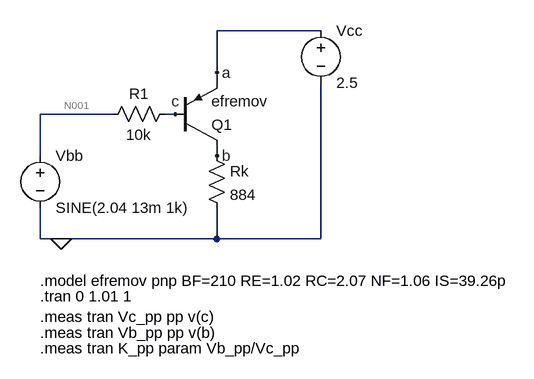
[diagram p0: schematic 2b.asc]
2b.asc, the LTspice schematic file:
Version 4
SHEET 1 880 680
WIRE 384 48 224 48
WIRE 224 112 224 48
WIRE 224 128 224 112
WIRE 64 176 -48 176
WIRE 160 176 144 176
WIRE -48 240 -48 176
WIRE 224 240 224 224
WIRE -48 368 -48 320
WIRE -16 368 -48 368
WIRE 224 368 224 320
WIRE 224 368 -16 368
WIRE 384 368 384 128
WIRE 384 368 224 368
FLAG -16 368 0
FLAG 224 112 a
FLAG 224 240 b
FLAG 160 176 c
SYMBOL pnp 160 224 M180
SYMATTR InstName Q1
SYMATTR Value efremov
SYMBOL voltage 384 32 R0
WINDOW 123 0 0 Left 0
WINDOW 39 0 0 Left 0
SYMATTR InstName Vcc
SYMATTR Value 2.5
SYMBOL res 160 160 R90
WINDOW 0 0 56 VBottom 2
WINDOW 3 32 56 VTop 2
SYMATTR InstName R1
SYMATTR Value 10k
SYMBOL res 208 224 R0
SYMATTR InstName Rk
SYMATTR Value 884
SYMBOL voltage -48 224 R0
WINDOW 123 0 0 Left 0
WINDOW 39 0 0 Left 0
SYMATTR InstName Vbb
SYMATTR Value SINE(2.04 13m 1k)
TEXT -48 432 Left 2 !.model efremov pnp BF=210 RE=1.02 RC=2.07 NF=1.06 IS=39.26p
TEXT -48 456 Left 2 !.tran 0 1.01 1
TEXT -48 488 Left 2 !.meas tran Vc_pp pp v(c)
TEXT -48 512 Left 2 !.meas tran Vb_pp pp v(b)
TEXT -48 536 Left 2 !.meas tran K_pp param Vb_pp/Vc_pp

The netlist it stands for:
* 2b.asc
Q1 b c a 0 efremov
Vcc a 0 2.5
R1 c N001 10k
Rk b 0 884
Vbb N001 0 SINE(2.04 13m 1k)
.model NPN NPN
.model PNP PNP
.lib standard.bjt
.model efremov pnp BF=210 RE=1.02 RC=2.07 NF=1.06 IS=39.26p
.tran 0 1.01 1
.meas tran Vc_pp pp v(c)
.meas tran Vb_pp pp v(b)
.meas tran K_pp param Vb_pp/Vc_pp
.backanno
.end

* Results of the author's LTspice run, read from the files saved beside the schematic
* Operating Point, zero values left out:
*   V(b) = 339.6 mV
*   V(c) = 2.058 V
*   V(a) = 2.5 V
*   V(n001) = 2.04 V
*   Ic(Q1) = -384.2 µA
*   Ib(Q1) = -1.829 µA
*   Ie(Q1) = 386 µA
*   I(Rk) = 384.2 µA
*   I(R1) = 1.829 µA
*   I(Vbb) = 1.829 µA
*   I(Vcc) = -386 µA
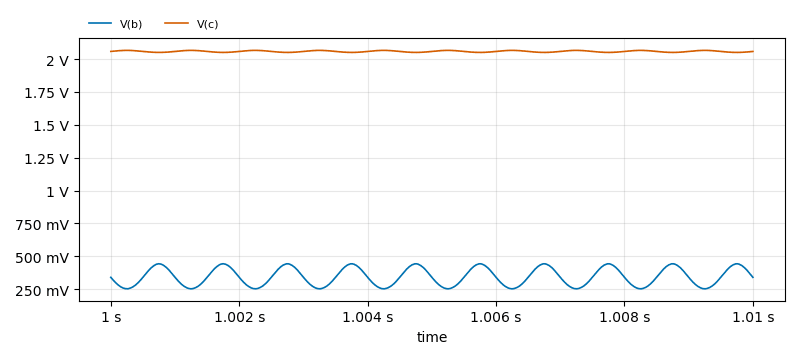
[diagram p1: Transient Analysis of 2b.asc, plotted from the saved traces]
* Transient Analysis, 1 run:
*   V(b): min 252.2 mV, max 442.9 mV, average 343.6 mV, rms 350.2 mV, last 339.6 mV
*   V(c): min 2.051 V, max 2.067 V, average 2.059 V, rms 2.059 V, last 2.058 V
* From the log:
*   vc_pp: PP(v(c))=0.0156603 FROM 0 TO 0.01
*   vb_pp: PP(v(b))=0.190706 FROM 0 TO 0.01
*   k_pp: vb_pp/vc_pp=12.1777